# EAGLE design ArdBir (EAGLE 7.3.0)
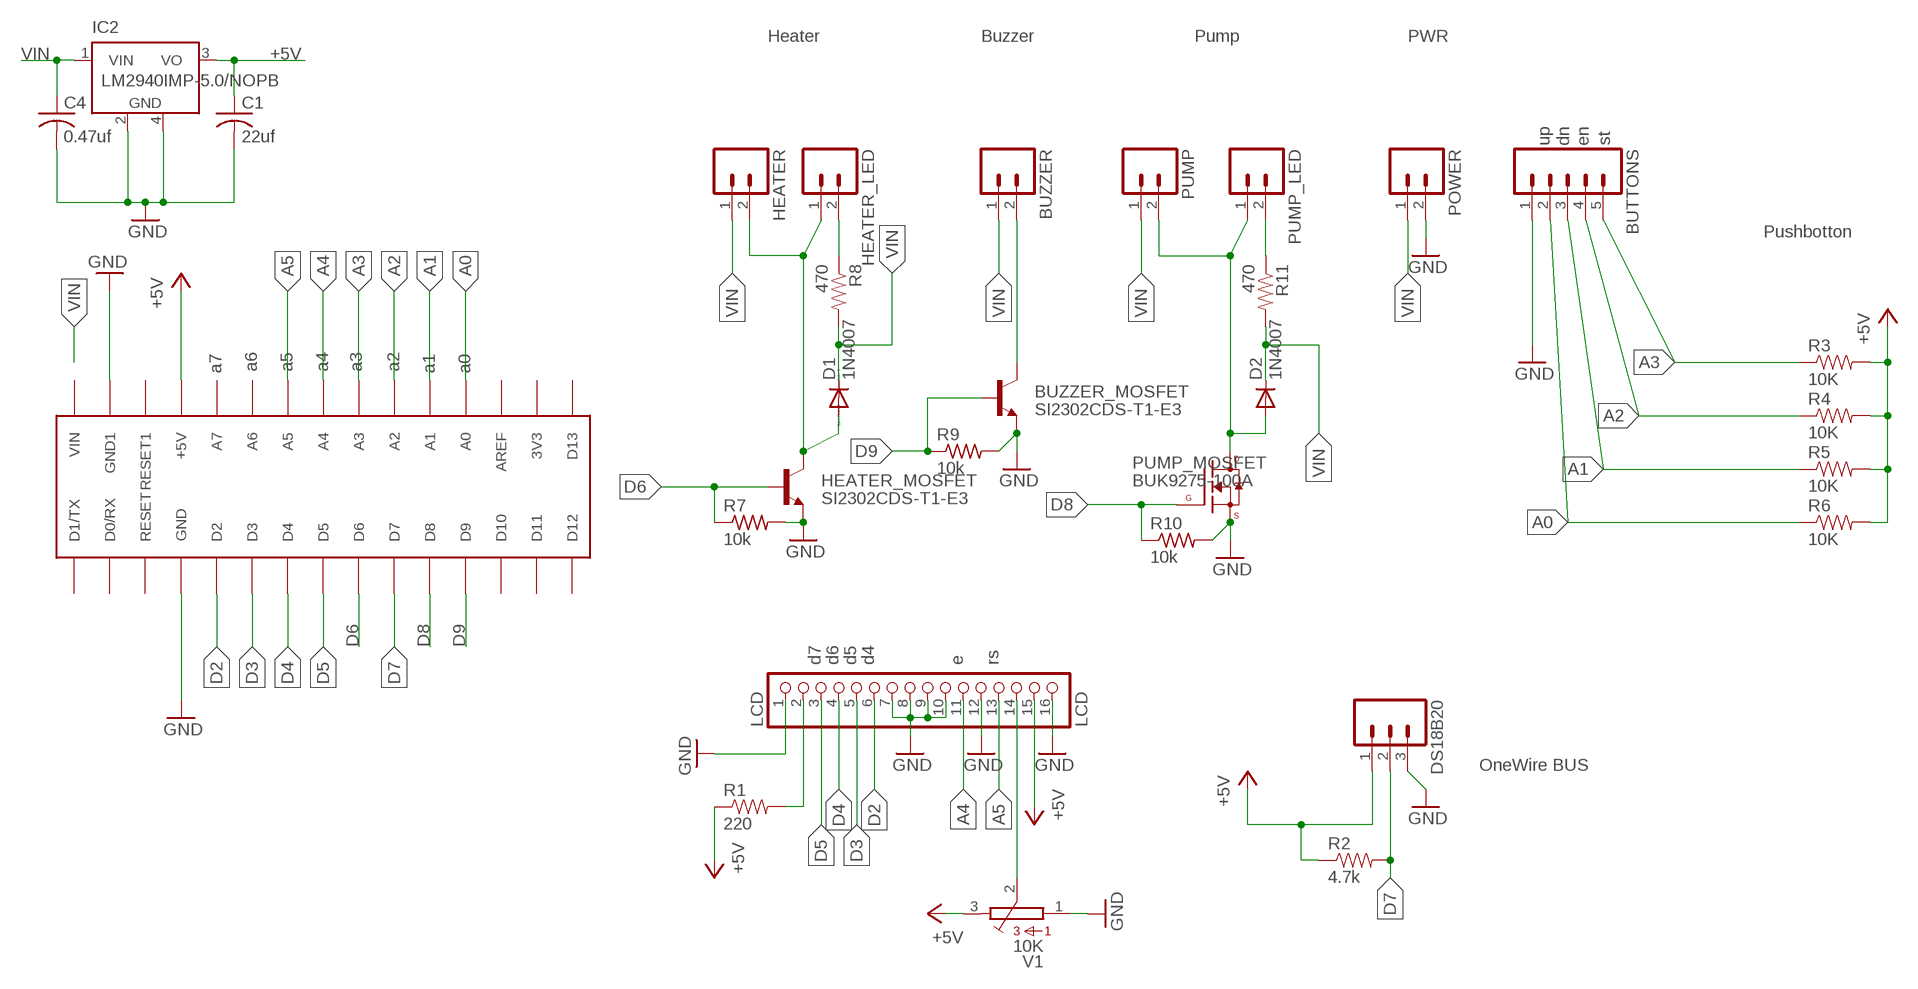
[diagram p0: schematic, sheet 1]

## Parts
BUTTONS  M05LOCK  [1X05_LOCK]
BUZZER  M02LOCK  [1X02_LOCK]
BUZZER_MOSFET  SI2302CDS-T1-E3  TRANSISTOR_NPNSOT23  [SOT23]
C1  22uf  C-USC0805  [C0805]
C4  0.47uf  C-USC0805  [C0805]
D1  1N4007  CGRM4007-G  [SOD-123_MINI-SMA]
D2  1N4007  DIODESMB  [SMB-DIODE]
DS18B20  M03LONGPADS  [1X03_LONGPADS]
HEATER  M023.5MM-NO_SILK  [SCREWTERMINAL-3.5MM-2-NS]
HEATER_LED  M02LOCK  [1X02_LOCK]
HEATER_MOSFET  SI2302CDS-T1-E3  TRANSISTOR_NPNSOT23  [SOT23]
IC2  LM2940IMP-5.0/NOPB  LM2936MP-5.0  [SOT223]
LCD  LCD  PINHD-1X16  [1X16]
POWER  M023.5MM-NO_SILK  [SCREWTERMINAL-3.5MM-2-NS]
PUMP  M023.5MM-NO_SILK  [SCREWTERMINAL-3.5MM-2-NS]
PUMP_LED  M02LOCK  [1X02_LOCK]
PUMP_MOSFET  BUK9275-100A  [DPAK]
R1  220  RESISTOR0805-RES  [0805]
R2  4.7k  RESISTOR0805-RES  [0805]
R3  10K  RESISTOR0805-RES  [0805]
R4  10K  RESISTOR0805-RES  [0805]
R5  10K  RESISTOR0805-RES  [0805]
R6  10K  RESISTOR0805-RES  [0805]
R7  10k  R-US_R0805  [R0805]
R8  470  RESISTOR0805-RES  [0805]
R9  10k  R-US_R0805  [R0805]
R10  10k  R-US_R0805  [R0805]
R11  470  RESISTOR0805-RES  [0805]
U$1  ARDUINONANO  [PDIP-32]
V1  10K  CA9V  [CA9V]

## Nets
+5V [PWR]: C1.1 DS18B20.1 IC2.3(VO) LCD.15 R1.1 R2.1 R3.2 R4.2 R5.2 R6.2 U$1.+5V V1.3
A0: BUTTONS.2 R6.1 U$1.A0
A1: BUTTONS.3 R5.1 U$1.A1
A2: BUTTONS.4 R4.1 U$1.A2
A3: BUTTONS.5 R3.1 U$1.A3
A4: LCD.11 U$1.A4
A5: LCD.13 U$1.A5
BUZZER_OUT: BUZZER.2 BUZZER_MOSFET.3(C)
D2: LCD.6 U$1.D2
D3: LCD.5 U$1.D3
D4: LCD.4 U$1.D4
D5: LCD.3 U$1.D5
D6: HEATER_MOSFET.1(B) R7.1 U$1.D6
D7: DS18B20.2 R2.2 U$1.D7
D8: PUMP_MOSFET.1(G) R10.1 U$1.D8
D9: BUZZER_MOSFET.1(B) R9.1 U$1.D9
GND: BUTTONS.1 BUZZER_MOSFET.2(E) C1.2 C4.2 DS18B20.3 HEATER_MOSFET.2(E) IC2.2(GND) IC2.4(GND) LCD.1 LCD.7 LCD.8 LCD.9 LCD.10 LCD.12 LCD.16 POWER.2 PUMP_MOSFET.3(S) R7.2 R9.2 R10.2 U$1.GND U$1.GND1 V1.1
HEATER_OUT: D1.A HEATER.2 HEATER_LED.1 HEATER_MOSFET.3(C)
N$1: PUMP_LED.2 R11.1
N$4: LCD.14 V1.2
N$5: HEATER_LED.2 R8.1
N$8: LCD.2 R1.2
PUMP_OUT: D2.A PUMP.2 PUMP_LED.1 PUMP_MOSFET.4(D)
VIN [PWR]: BUZZER.1 C4.1 D1.C D2.C HEATER.1 IC2.1(VIN) POWER.1 PUMP.1 R8.2 R11.2
Unconnected: U$1.3V3 U$1.A6 U$1.A7 U$1.AREF U$1.D0/RX U$1.D1/TX U$1.D10 U$1.D11 U$1.D12 U$1.D13 U$1.RESET U$1.RESET1 U$1.VIN

## Notes on the sheet
- Heater | Buzzer | Pump | PWR
- up | dn | en | st
- Pushbotton
- a7 | a6 | a5 | a4 | a3 | a2 | a1 | a0
- d7 | d6 | d5 | d4 | e | rs
- OneWire BUS

## Library data of the parts
BUTTONS = SparkFun:M05: Header 5 Standard 5-pin 0.1" header. Use with straight break away headers (SKU : PRT-00116), right angle break away headers (PRT-00553), swiss pins (PRT-00743), machine pins (PRT-00117), and female headers (PRT-00115). Molex polarized connector foot print use with SKU : PRT-08230 with associated crimp pins and housings.
BUZZER HEATER HEATER_LED POWER PUMP PUMP_LED = SparkFun:M02: Header 2 Standard 2-pin 0.1" header. Use with straight break away headers (SKU : PRT-00116), right angle break away headers (PRT-00553), swiss pins (PRT-00743), machine pins (PRT-00117), and female headers (PRT-00115). Molex polarized connector foot print use with SKU : PRT-08233 with associated crimp pins and housings.
BUZZER_MOSFET HEATER_MOSFET = SparkFun:TRANSISTOR_NPN: Transistor NPN BJT configuration in SOT23 package. MMBT2222 is the common NPN we use. Double check BCE configuration again layout.
C1 C4 = rcl:C-US: CAPACITOR, American symbol
D1 = diode:CGRM400*-G: Molded plasitc,JEDEC SOD-123/Mini SMA Source: Comchip CGRM4001-G.pdf; OC_NEWARK: unknown
D2 = SparkFun:DIODE: Diode These are standard reverse protection diodes and small signal diodes. SMA package can handle up to about 1A. SOD-323 can handle about 200mA. What the SOD-323 package when ordering, there are some mfgs out there that are 5-pin packages.; OC_NEWARK: unknown
DS18B20 = SparkFun:M03: Header 3 Standard 3-pin 0.1" header. Use with straight break away headers (SKU : PRT-00116), right angle break away headers (PRT-00553), swiss pins (PRT-00743), machine pins (PRT-00117), and female headers (PRT-00115). Molex polarized connector foot print use with SKU : PRT-08232 with associated crimp pins and housings.
IC2 = national-semiconductor:LM2936MP?*: Ultra-Low Quiescent Current LDO Voltage Regulator Source: Data sheet <http://www.national.com/ds/LM/LM2936.pdf>; MF: NATIONAL SEMICONDUCTOR; MPN: LM2936MP-5.0/NOPB; OC_FARNELL: 1469063; OC_NEWARK: 41K4524
LCD = pinhead:PINHD-1X16: PIN HEADER; OC_NEWARK: unknown
PUMP_MOSFET = dpak:BUK9275-100A: N-channel TrenchMOS logic level FET
R1-R6 R8 R11 = SparkFun:RESISTOR: Resistor Basic schematic elements and footprints for 0603, 1206, and PTH resistors.; OC_NEWARK: unknown
R7 R9 R10 = adafruit:R-US_: RESISTOR, American symbol
U$1 = jet-lib:ARDUINONANO
V1 = pot:CA9V: POTENTIOMETER; OC_NEWARK: unknown

## Net classes
1 PWR: width 0.152 mm, clearance 0.152 mm

## Board
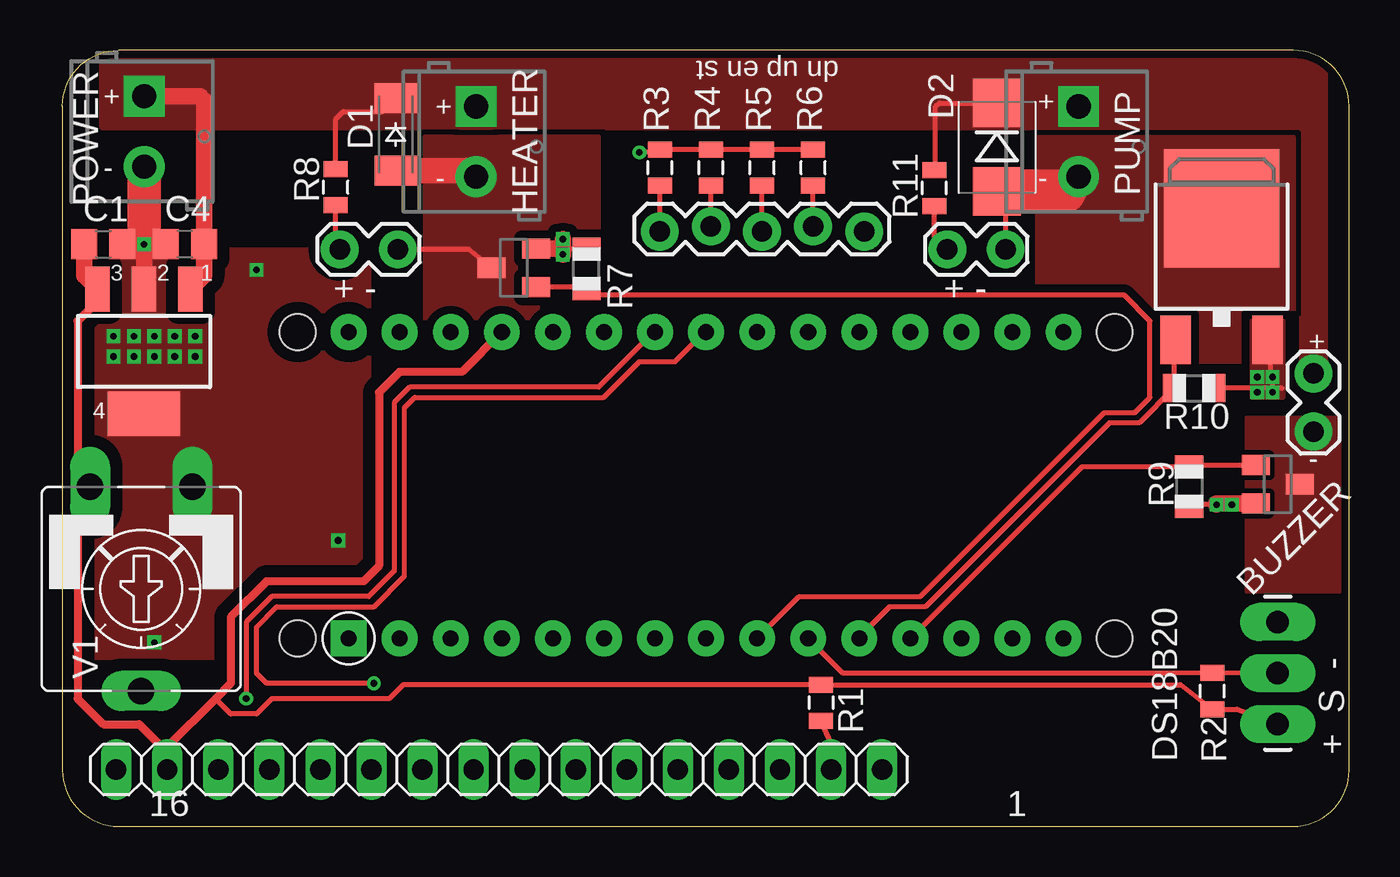
[diagram p1: board, top side]
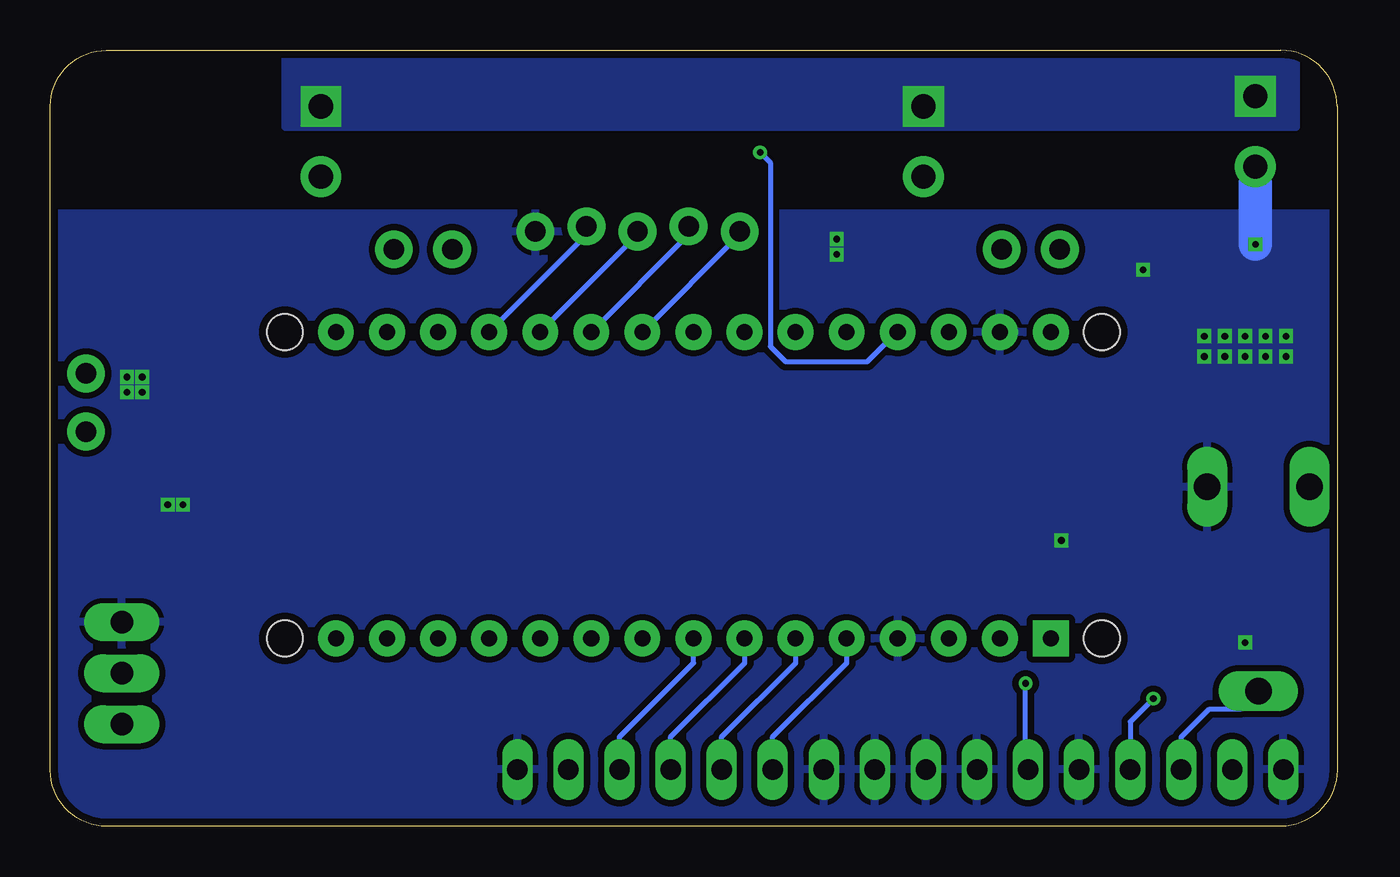
[diagram p2: board, bottom side, seen from below]

Size 64.01 x 38.61 mm. Coordinates in mm from the lower left corner, seen from the top.
Outline: 2.79,0 61.21,0 arc90 64.01,2.79 64.01,35.81 arc90 61.21,38.61 2.79,38.61 arc90 0,35.81 0,2.79 arc90 2.79,0
Copper layers (1*16): Top 0.0356mm / dielectric 1.5011mm / Bottom 0.0356mm
Design rules "LaenPCBOrder *": minimum track width 6mil, minimum drill 13mil, track to track 6mil, track to pad 6mil, pad to pad 6mil, via to via 6mil, smd to smd 6mil, copper to edge 15mil, drill to drill 6mil, minimum pad ring 7mil, minimum via ring 7mil, stop-mask expansion 4mil, vias tented up to drill 16mil, thermal gap 10mil

### Footprints (pad centres in the part's own frame; a part is rotated, then mirrored left to right if it is on the bottom)
1X05_LOCK = drill 1.016 pad 1.88: 1 0,0.127; 2 2.54,-0.127; 3 5.08,0.127; 4 7.62,-0.127; 5 10.16,0.127
1X02_LOCK = drill 1.016 pad 1.88: 1 -0.178,0; 2 2.718,0
SOT23 = smd 1 x 1.4: 1 -0.95,-1.1; 2 0.95,-1.1; 3 0,1.1
C0805 = smd 1.3 x 1.5: 1 -0.95,0; 2 0.95,0
SOD-123_MINI-SMA = smd 1.5 x 2.1: A 1.8,0; C -1.8,0
SMB-DIODE = smd 2.4 x 2.4: A 2.2,0; C -2.2,0
1X03_LONGPADS = drill 1.118 pad 1.88 long: 1 0,0; 2 2.54,0; 3 5.08,0
SCREWTERMINAL-3.5MM-2-NS = drill 1.2 pad 2.032 square: 1 0,0 | drill 1.2 pad 2.032: 2 3.5,0
SOT223 = smd 1.219 x 2.235: 1 -2.311,-3.099; 2 0,-3.099; 3 2.311,-3.099 | smd 3.6 x 2.2: 4 0,3.099
1X16 = drill 1.016 long: 1 -19.05,0; 2 -16.51,0; 3 -13.97,0; 4 -11.43,0; 5 -8.89,0; 6 -6.35,0; 7 -3.81,0; 8 -1.27,0; 9 1.27,0; 10 3.81,0; 11 6.35,0; 12 8.89,0; 13 11.43,0; 14 13.97,0; 15 16.51,0; 16 19.05,0
DPAK = smd 1.5 x 2.4: 1 -2.285,-6.525; 3 2.285,-6.525 | smd 5.75 x 5.9: 4 0,0
0805 = smd 0.8 x 1.2: 1 -0.9,0; 2 0.9,0
R0805 = smd 1.1 x 1.4: 1 -1,0; 2 1,0
PDIP-32 = drill 0.8 pad 1.778: 3V3 15.24,-35.56; +5V 15.24,-10.16; A0 15.24,-30.48; A1 15.24,-27.94; A2 15.24,-25.4; A3 15.24,-22.86; A4 15.24,-20.32; A5 15.24,-17.78; A6 15.24,-15.24; A7 15.24,-12.7; AREF 15.24,-33.02; D0/RX 0,-5.08; D2 0,-12.7; D3 0,-15.24; D4 0,-17.78; D5 0,-20.32; D6 0,-22.86; D7 0,-25.4; D8 0,-27.94; D9 0,-30.48; D10 0,-33.02; D11 0,-35.56; D12 0,-38.1; D13 15.24,-38.1; GND 0,-10.16; GND1 15.24,-5.08; RESET 0,-7.62; RESET1 15.24,-7.62; VIN 15.24,-2.54 | drill 0.8 pad 1.778 square: D1/TX 0,-2.54 | hole 1.778: 0,0; 0,-40.64; 15.24,-40.64; 15.24,0
CA9V = drill 1.321 long: 1 -2.54,-5.08; 2 0,5.08; 3 2.54,-5.08

### Placement (x,y rotation side)
BUTTONS  39.88,29.72 180 top
BUZZER  62.23,22.35 270 top
BUZZER_MOSFET  60.45,17.02 270 top
C1  2.03,28.96 0 top
C4  6.1,28.96 180 top
D1  16.58,34.43 270 top
D2  46.48,33.78 270 top
DS18B20  60.45,5.08 90 top
HEATER  20.57,35.81 270 top
HEATER_LED  16.51,28.7 180 top
HEATER_MOSFET  22.45,27.78 90 top
IC2  4.06,23.62 180 top
LCD  21.72,2.82 180 top
POWER  4.06,36.32 270 top
PUMP  50.55,35.81 270 top
PUMP_LED  46.74,28.7 180 top
PUMP_MOSFET  57.66,30.73 0 top
R1  37.74,6.15 270 top
R2  57.19,6.73 90 top
R3  29.72,32.77 90 top
R4  32.26,32.77 90 top
R5  34.8,32.77 90 top
R6  37.34,32.77 90 top
R7  26.07,27.74 90 top
R8  13.59,31.8 90 top
R9  56.04,16.9 270 top
R10  56.29,21.8 0 top
R11  43.37,31.75 90 top
U$1  11.7,9.34 90 top
V1  3.92,11.81 180 top

### Tracks (layer width: path | path; a pad name or v marks a point on that pad's centre or on a via)
+5V  (via drill 0.33)
  Top 0.254: DS18B20.1 58.44,5.83 R2.1 55.62,7.05 R1.1 16.95,7.05 16.26,6.35 10.41,6.35 9.65,5.59 8.38,5.59 7.62,6.35 | R6.2 R5.2 R4.2 R3.2 29.58,33.53 v28.7,33.53
  Top 0.406: IC2.3 1.75,26.14 0.76,25.15 0.76,17.5 V1.3 0.76,16.27 0.76,6.35 2.03,5.08 3.81,5.08 5.21,3.68 LCD.15 5.21,3.94 7.62,6.35 8.38,7.11 8.38,10.41 10.16,12.19 14.99,12.19 15.75,12.95 15.75,21.59 16.76,22.61 19.88,22.61 U$1.+5V
  Top 0.813: IC2.3 1.08,27.39 C1.1
  Bottom 0.254: v28.7,33.53 28.19,33.02 28.19,23.88 27.43,23.11 23.37,23.11 21.9,24.59 U$1.+5V
A0
  Top 0.254: BUTTONS.2 R6.1
  Bottom 0.254: U$1.A0 37.34,29.42 BUTTONS.2
A1
  Top 0.254: BUTTONS.3 R5.1
  Bottom 0.254: U$1.A1 34.8,29.42 BUTTONS.3
A2
  Top 0.254: BUTTONS.4 R4.1
  Bottom 0.254: U$1.A2 32.26,29.42 BUTTONS.4
A3
  Top 0.254: BUTTONS.5 R3.1
  Bottom 0.254: U$1.A3 29.72,29.42 BUTTONS.5
A4  (via drill 0.33)
  Top 0.254: v15.49,7.11 10.16,7.11 9.65,7.62 9.65,9.91 10.67,10.92 15.49,10.92 17.02,12.45 17.02,20.83 17.53,21.34 26.92,21.34 28.7,23.11 30.48,23.11 32.02,24.65 U$1.A4
  Bottom 0.254: LCD.11 15.49,2.94 v15.49,7.11
A5  (via drill 0.33)
  Top 0.254: U$1.A5 29.46,24.57 29.46,24.64 26.67,21.84 17.27,21.84 16.51,21.08 16.51,12.7 15.24,11.43 10.41,11.43 9.14,10.16 v9.14,6.35
  Bottom 0.254: v9.14,6.35 10.29,5.2 LCD.13
BUZZER_OUT
  pour Top (isolate 0.254, no thermals): 63.5,20.32 63.5,11.68 58.93,11.68 58.93,20.32
D2
  Bottom 0.254: LCD.6 28.07,4.44 24.38,8.13 24.38,9.33 U$1.D2
D3
  Bottom 0.254: LCD.5 30.61,4.44 26.92,8.13 26.92,9.33 U$1.D3
D4
  Bottom 0.254: LCD.4 33.15,4.44 29.46,8.13 29.46,9.33 U$1.D4
D5
  Bottom 0.254: LCD.3 35.69,4.44 32,8.13 32,9.33 U$1.D5
D6
  Top 0.254: U$1.D6 36.64,11.43 42.67,11.43 51.82,20.57 53.34,20.57 54.1,21.34 54.1,25.15 52.83,26.42 26.16,26.42 25.81,26.76 R7.1 25.47,26.83 HEATER_MOSFET.1
D7
  Top 0.254: DS18B20.2 60.25,7.62 R2.2 56.9,7.63 54.86,7.62 38.82,7.62 U$1.D7
D8
  Top 0.254: PUMP_MOSFET.1 55.29,24.03 R10.1 53.56,20.07 52.07,20.07 42.93,10.92 41.15,10.92 39.64,9.41 U$1.D8
D9
  Top 0.254: U$1.D9 50.73,17.9 R9.1 56.37,17.97 BUZZER_MOSFET.1
GND  (via drill 0.33)
  Top 0.254: PUMP_MOSFET.3 60.2,21.67 | 60.66,21.8 R10.2 | v57.4,16 56.29,16 R9.2 | v24.89,29.21 24.89,28.74 R7.2
  Top 0.813: C4.2 v4.06,28.96 | v4.06,28.96 C1.2 | v4.06,28.96 IC2.2 | BUZZER_MOSFET.2 57.4,16.07 v57.4,16 | HEATER_MOSFET.2 24.89,28.73 v24.89,28.45 v24.89,29.21
  Top 1.676: 4.06,32 v4.06,28.96 POWER.2
  Bottom 1.676: v4.06,28.96 4.06,32
  other vias: 59.44,22.35 6.6,24.38 5.59,24.38 4.57,24.38 3.56,24.38 2.54,24.38 4.57,9.14 2.54,23.37 3.56,23.37 4.57,23.37 5.59,23.37 6.6,23.37 13.72,14.22 9.65,27.69 58.17,16 60.2,22.35 60.2,21.59 59.44,21.59
  pour Bottom (isolate 0.305, rank 6): 0,30.48 63.75,30.48 63.75,0.25 0,0
  pour Top (isolate 0.61, rank 4, no thermals): 15.24,28.7 15.24,8.38 1.52,8.38 1.52,28.7
  pour Top (no thermals): 59.18,25.15 60.71,25.15 60.71,21.34 59.18,21.34
HEATER_OUT
  Top 0.254: HEATER_MOSFET.3 20.24,28.7 HEATER_LED.1
  Top 1.27: HEATER.2 20.26,32.63 D1.A
  pour Top (isolate 0.406, no thermals): 18.03,34.29 18.03,24.64 26.67,24.64 26.67,34.29
N$1
  Top 0.254: PUMP_LED.2 43.37,29.35 R11.1
N$4
  Bottom 0.254: LCD.14 7.75,4.44 6.35,5.84 4.8,5.84 V1.2
N$5
  Top 0.254: HEATER_LED.2 13.59,29.15 R8.1
N$8
  Top 0.254: LCD.2 38.24,4.09 R1.2
PUMP_OUT
  Top 0.254: D2.A 46.91,31.15 PUMP_LED.1
  Top 1.27: PUMP.2 49.81,31.58
  Top 2.184: 49.81,31.58 D2.A
  pour Top (isolate 0.406, rank 2, no thermals): 61.21,34.29 61.21,23.11 48.51,23.11 48.51,34.29
VIN
  Top 0.254: R8.2 13.59,35.18 13.97,35.56 15.92,35.56 D1.C | R11.2 43.43,32.72 43.43,35.81 43.6,35.98 D2.C
  Top 0.813: POWER.1 6.86,36.32 7.05,36.13 C4.1 7.05,27.39 IC2.1
  pour Top (isolate 0.254, rank 5, no thermals): 2.03,38.61 62.74,38.61 62.74,22.1 61.72,22.1 61.72,34.8 2.03,34.8
  pour Bottom (isolate 0.254, no thermals): 2.03,34.8 2.03,38.61 52.32,38.61 52.32,34.8

### Text on the board
_tsilk: dn up en st | + | + | + | - | - | - | + - | + - | + | - | + S - | 16 | 1